# EAGLE design apollo-ctrl (EAGLE 7.6.0)
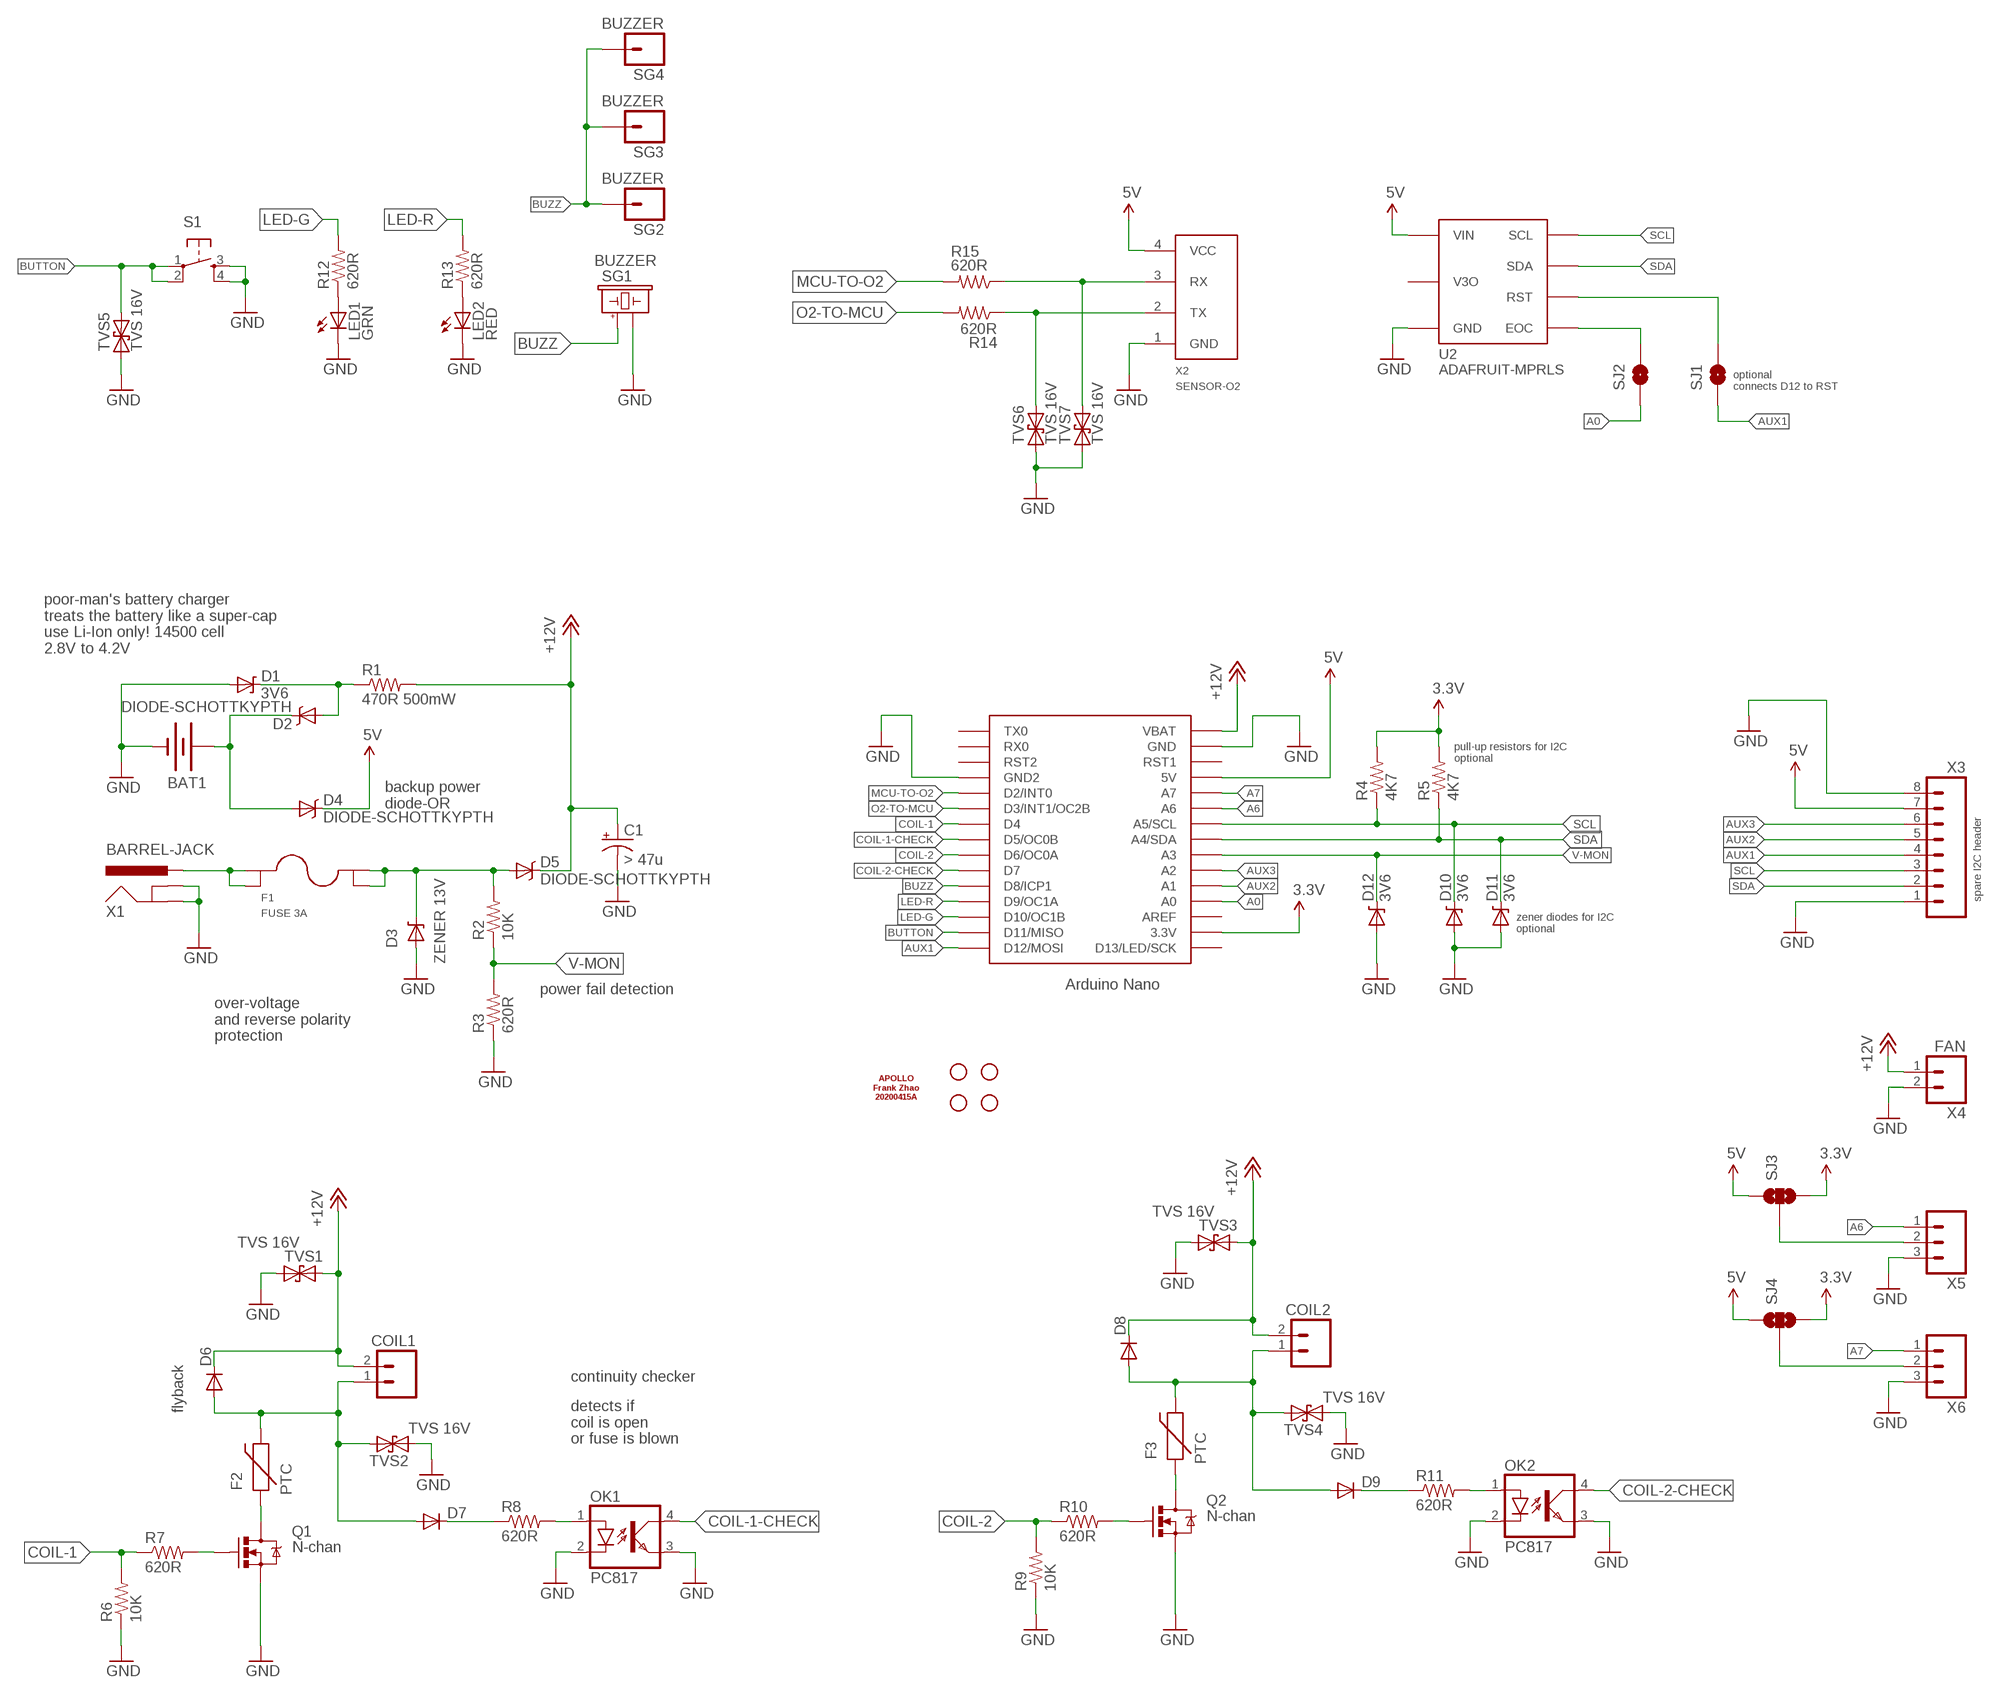
[diagram p0: schematic, sheet 1]

## Parts
BAT1  BATTERYAA-KIT  [BATTERY-AA-KIT]
C1  > 47u  CAP_POLPTH4  [CPOL-RADIAL-1000UF-25V]
COIL1  M023.5MM  [SCREWTERMINAL-3.5MM-2]
COIL2  M023.5MM  [SCREWTERMINAL-3.5MM-2]
D1  3V6  DIODE-ZENER1N4148  [DIODE-1N4148]
D2  DIODE-SCHOTTKYPTH  [DIODE-1N4001]
D3  ZENER 13V  DIODE-ZENER-DO201-15  [DO201-15]
D4  DIODE-SCHOTTKYPTH  [DIODE-1N4001]
D5  DIODE-SCHOTTKYPTH  [DIODE-1N4001]
D6  DIODE1N4148  [DIODE-1N4148]
D7  DIODE1N4148  [DIODE-1N4148]
D8  DIODE1N4148  [DIODE-1N4148]
D9  DIODE1N4148  [DIODE-1N4148]
D10  3V6  DIODE-ZENER1N4148  [DIODE-1N4148]
D11  3V6  DIODE-ZENER1N4148  [DIODE-1N4148]
D12  3V6  DIODE-ZENER1N4148  [DIODE-1N4148]
F1  FUSE 3A  FUSE-4PIN-KEYSTONE-3568  [FUSE-KEYSTONE-3568]
F2  PTC  PTCPTH  [PTC]
F3  PTC  PTCPTH  [PTC]
JP1  STAND-OFF  [STAND-OFF]
JP2  STAND-OFF  [STAND-OFF]
JP3  STAND-OFF  [STAND-OFF]
JP4  STAND-OFF  [STAND-OFF]
LED1  GRN  LED5MM  [LED5MM]
LED2  RED  LED5MM  [LED5MM]
LOGO1  APOLLO-LOGO  [APOLLO-LOGO]
OK1  PC817  [DIL04]
OK2  PC817  [DIL04]
Q1  N-chan  MOSFET-NCHANNELPTH2  [TO220V]
Q2  N-chan  MOSFET-NCHANNELPTH2  [TO220V]
R1  470R 500mW  RESISTORPTH-1/2W  [AXIAL-0.5]
R2  10K  RESISTORPTH-1/4W  [AXIAL-0.4]
R3  620R  RESISTORPTH-1/4W  [AXIAL-0.4]
R4  4K7  RESISTORPTH-1/4W  [AXIAL-0.4]
R5  4K7  RESISTORPTH-1/4W  [AXIAL-0.4]
R6  10K  RESISTORPTH-1/4W  [AXIAL-0.4]
R7  620R  RESISTORPTH-1/4W  [AXIAL-0.4]
R8  620R  RESISTORPTH-1/4W  [AXIAL-0.4]
R9  10K  RESISTORPTH-1/4W  [AXIAL-0.4]
R10  620R  RESISTORPTH-1/4W  [AXIAL-0.4]
R11  620R  RESISTORPTH-1/4W  [AXIAL-0.4]
R12  620R  RESISTORPTH-1/4W  [AXIAL-0.4]
R13  620R  RESISTORPTH-1/4W  [AXIAL-0.4]
R14  620R  RESISTORPTH-1/4W  [AXIAL-0.4]
R15  620R  RESISTORPTH-1/4W  [AXIAL-0.4]
S1  TAC_SWITCHPTH  [TACTILE-PTH]
SG1  BUZZER  BUZZER-POL-AI-3035  [BUZZER-AI-3035]
SG2  BUZZER  M01-TH-NS  [1X01NS]
SG3  BUZZER  M01-TH-NS  [1X01NS]
SG4  BUZZER  M01-TH-NS  [1X01NS]
SJ1  SOLDERJUMPERNO  [SJ_2S-NO]
SJ2  SOLDERJUMPERNO  [SJ_2S-NO]
SJ3  SOLDERJUMPER_2WAYS  [SJ_3]
SJ4  SOLDERJUMPER_2WAYS  [SJ_3]
TVS1  TVS 16V  TVS1N4148  [DIODE-1N4148]
TVS2  TVS 16V  TVS1N4148  [DIODE-1N4148]
TVS3  TVS 16V  TVS1N4148  [DIODE-1N4148]
TVS4  TVS 16V  TVS1N4148  [DIODE-1N4148]
TVS5  TVS 16V  TVS1N4148  [DIODE-1N4148]
TVS6  TVS 16V  TVS1N4148  [DIODE-1N4148]
TVS7  TVS 16V  TVS1N4148  [DIODE-1N4148]
U1  NANO  [NANO]
U2  ADAFRUIT-MPRLS  ADAFRUIT-MPRLS-W-HOLES  [ADAFRUIT-MPRLS]
X1  BARREL-JACK  POWER_JACKPTH  [POWER_JACK_PTH]
X2  SENSOR-O2  SENSOR-O2-JST-VERT  [JST-PH-4-VERT]
X3  M081X08  [1X08]
X4  FAN  M02PTH  [1X02]
X5  M03PTH  [1X03]
X6  M03PTH  [1X03]

## Nets
3.3V: R4.P$2 R5.P$2 SJ3.3 SJ4.3 U1.3.3V
5V: D4.C SJ3.1 SJ4.1 U1.5V U2.VIN X2.4(VCC) X3.7
+12V: C1.1(+) COIL1.2 COIL2.2 D5.C D6.C D8.C R1.P$2 TVS1.C TVS3.C U1.RAW(VBAT) X4.1
A0: SJ2.1 U1.A0
A6: U1.A6 X5.1
A7: U1.A7 X6.1
AUX1: SJ1.1 U1.D12(D12/MOSI) X3.4
AUX2: U1.A1 X3.5
AUX3: U1.A2 X3.6
BUTTON: S1.1 S1.2 TVS5.C U1.D11(D11/MISO)
BUZZ: SG1.P SG2.1 SG3.1 SG4.1 U1.D8(D8/ICP1)
COIL-1: R6.P$2 R7.P$1 U1.D4
COIL-1-CHECK: OK1.4(COL) U1.D5(D5/OC0B)
COIL-2: R9.P$2 R10.P$1 U1.D6(D6/OC0A)
COIL-2-CHECK: OK2.4(COL) U1.D7
GND: BAT1.GND@1(-) C1.2(-) D1.A D3.A D10.A D11.A D12.A LED1.K(C) LED2.K(C) OK1.2(C) OK1.3(EMIT) OK2.2(C) OK2.3(EMIT) Q1.3(S) Q2.3(S) R3.P$1 R6.P$1 R9.P$1 S1.3 S1.4 SG1.N TVS1.A TVS2.A TVS3.A TVS4.A TVS5.A TVS6.A TVS7.A U1.GND U1.GND1(GND2) U2.GND X1.GND X1.GNDBREAK X2.1(GND) X3.1 X3.8 X4.2 X5.3 X6.3
LED-G: R12.P$2 U1.D10(D10/OC1B)
LED-R: R13.P$2 U1.D9(D9/OC1A)
MCU-TO-O2: R15.P$2 U1.D2(D2/INT0)
N$1: SJ1.2 U2.RST
N$2: F2.1 Q1.2(D)
N$3: Q1.1(G) R7.P$2
N$4: OK1.1(A) R8.P$2
N$5: COIL1.1 D6.A D7.A F2.2 TVS2.C
N$6: F1.1A F1.1B X1.PWR
N$7: D7.C R8.P$1
N$8: OK2.1(A) R11.P$2
N$9: Q2.1(G) R10.P$2
N$10: COIL2.1 D8.A D9.A F3.2 TVS4.C
N$11: F3.1 Q2.2(D)
N$12: D9.C R11.P$1
N$13: D3.C D5.A F1.2A F1.2B R2.P$2
N$14: BAT1.PWR@1(+) D2.C D4.A
N$15: LED2.A R13.P$1
N$16: LED1.A R12.P$1
N$17: R14.P$1 TVS6.C X2.2(TX)
N$18: R15.P$1 TVS7.C X2.3(RX)
N$19: D1.C D2.A R1.P$1
N$20: SJ2.2 U2.EOC
N$21: SJ4.2 X6.2
N$22: SJ3.2 X5.2
O2-TO-MCU: R14.P$2 U1.D3(D3/INT1/OC2B)
SCL: D10.C R4.P$1 U1.A5(A5/SCL) U2.SCL X3.3
SDA: D11.C R5.P$1 U1.A4(A4/SDA) U2.SDA X3.2
V-MON: D12.C R2.P$1 R3.P$2 U1.A3
Unconnected: U1.AREF U1.D13(D13/LED/SCK) U1.RST1(RST2) U1.RST(RST1) U1.RX0 U1.TX0 U2.V3O

## Notes on the sheet
- optional
  connects D12 to RST
- poor-man's battery charger
  treats the battery like a super-cap
  use Li-Ion only! 14500 cell
  2.8V to 4.2V
- pull-up resistors for I2C
  optional
- backup power
  diode-OR
- spare I2C header
- zener diodes for I2C
  optional
- power fail detection
- over-voltage
  and reverse polarity
  protection
- continuity checker
- flyback
- detects if
  coil is open
  or fuse is blown

## Library data of the parts
BAT1 = apollo-ctrl:BATTERY: Battery Holders Various common sizes : AA, AAA, 20mm coin cell and 12mm coin cell.
C1 = apollo-ctrl:CAP_POL: Capacitor Polarized These are standard SMD and PTH capacitors. Normally 10uF, 47uF, and 100uF in electrolytic and tantalum varieties. Always verify the external diameter of the through hole cap, it varies with capacity, voltage, and manufacturer. The EIA devices should be standard.
COIL1 COIL2 X4 = apollo-ctrl:M02: Header 2 Standard 2-pin 0.1" header. Use with straight break away headers (SKU : PRT-00116), right angle break away headers (PRT-00553), swiss pins (PRT-00743), machine pins (PRT-00117), and female headers (PRT-00115). Molex polarized connector foot print use with SKU : PRT-08233 with associated crimp pins and housings.
D1 D3 D10-D12 = apollo-ctrl:DIODE-ZENER: Zener Diode Production Part - 8199 3.4V Zener Voltage
D2 D4 D5 = apollo-ctrl:DIODE-SCHOTTKY
D6-D9 = apollo-ctrl:DIODE: Diode These are standard reverse protection diodes and small signal diodes. SMA package can handle up to about 1A. SOD-323 can handle about 200mA. What the SOD-323 package when ordering, there are some mfgs out there that are 5-pin packages.
F1 = apollo-ctrl:FUSE-4PIN
F2 F3 = apollo-ctrl:PTC: Resettable Fuse PTC Resettable Fuse. Spark Fun Electronics SKU : COM-08357; SKU: RHEF070HF-ND
JP1-JP4 = apollo-ctrl:STAND-OFF: Stand Off This is the mechanical footprint for a #4 phillips button head screw. Use the keepout ring to avoid running the screw head into surrounding components. SKU : PRT-00447
LED1 LED2 = apollo-ctrl:LED: LEDs Standard schematic elements and footprints for 5mm, 3mm, 1206, and 0603 sized LEDs. 5mm - Spark Fun Electronics SKU : COM-00529 (and others)
LOGO1 = apollo-ctrl:APOLLO-LOGO
OK1 OK2 = apollo-ctrl:PC817: SHARP OPTO COUPLER; MPN: PC817X4J000F; OC_FARNELL: 9707727; OC_NEWARK: 97K7059
Q1 Q2 = apollo-ctrl:MOSFET-NCHANNEL
R1-R15 = apollo-ctrl:RESISTOR: Resistor Basic schematic elements and footprints for 0603, 1206, and PTH resistors.
S1 = apollo-ctrl:TAC_SWITCH: Momentary Switch Button commonly used for reset or general input. Spark Fun Electronics SKU : COM-00097
SG1 = apollo-ctrl:BUZZER-POL
SG2-SG4 = apollo-ctrl:M01: Header 1 Standard 1-pin 0.1" header. Use with straight break away headers (SKU : PRT-00116), right angle break away headers (PRT-00553), swiss pins (PRT-00743), machine pins (PRT-00117), and female headers (PRT-00115).
SJ1 SJ2 = apollo-ctrl:SOLDERJUMPER: Solder Jumper Standard SMD solder jumper. Used to automate production. Two varients : Normally Open and Normally Closed are the same, but have different paste layers. NC will have a large amount of paste and should jumper during reflow.
SJ3 SJ4 = apollo-ctrl:SOLDERJUMPER_2WAY: Solder Jumper 2 way solder jumper
TVS1 TVS3 TVS5-TVS7 = apollo-ctrl:TVS
TVS2 TVS4 = apollo-ctrl:TVS; SKU: P6KE16CALFCT-ND
U1 = apollo-ctrl:NANO: Arduino Nano
U2 = apollo-ctrl:ADAFRUIT-MPRLS
X1 = apollo-ctrl:POWER_JACK: Power Jack This is the standard 5.5mm barrel jack for power. The PTH is the most common, proven, reliable, footprint. All others are experimental. The Slot footprint only works if the mill layer is transmitted to the PCB fab house so be warned. Spark Fun Electronics SKU : PRT-00119. Mating wall wart : TOL-00298 (and others)
X2 = apollo-ctrl:SENSOR-O2
X3 = apollo-ctrl:M08: Header 8 Standard 8-pin 0.1" header. Use with straight break away headers (SKU : PRT-00116), right angle break away headers (PRT-00553), swiss pins (PRT-00743), machine pins (PRT-00117), and female headers (PRT-00115).
X5 X6 = apollo-ctrl:M03: Header 3 Standard 3-pin 0.1" header. Use with straight break away headers (SKU : PRT-00116), right angle break away headers (PRT-00553), swiss pins (PRT-00743), machine pins (PRT-00117), and female headers (PRT-00115). Molex polarized connector foot print use with SKU : PRT-08232 with associated crimp pins and housings.

## Board
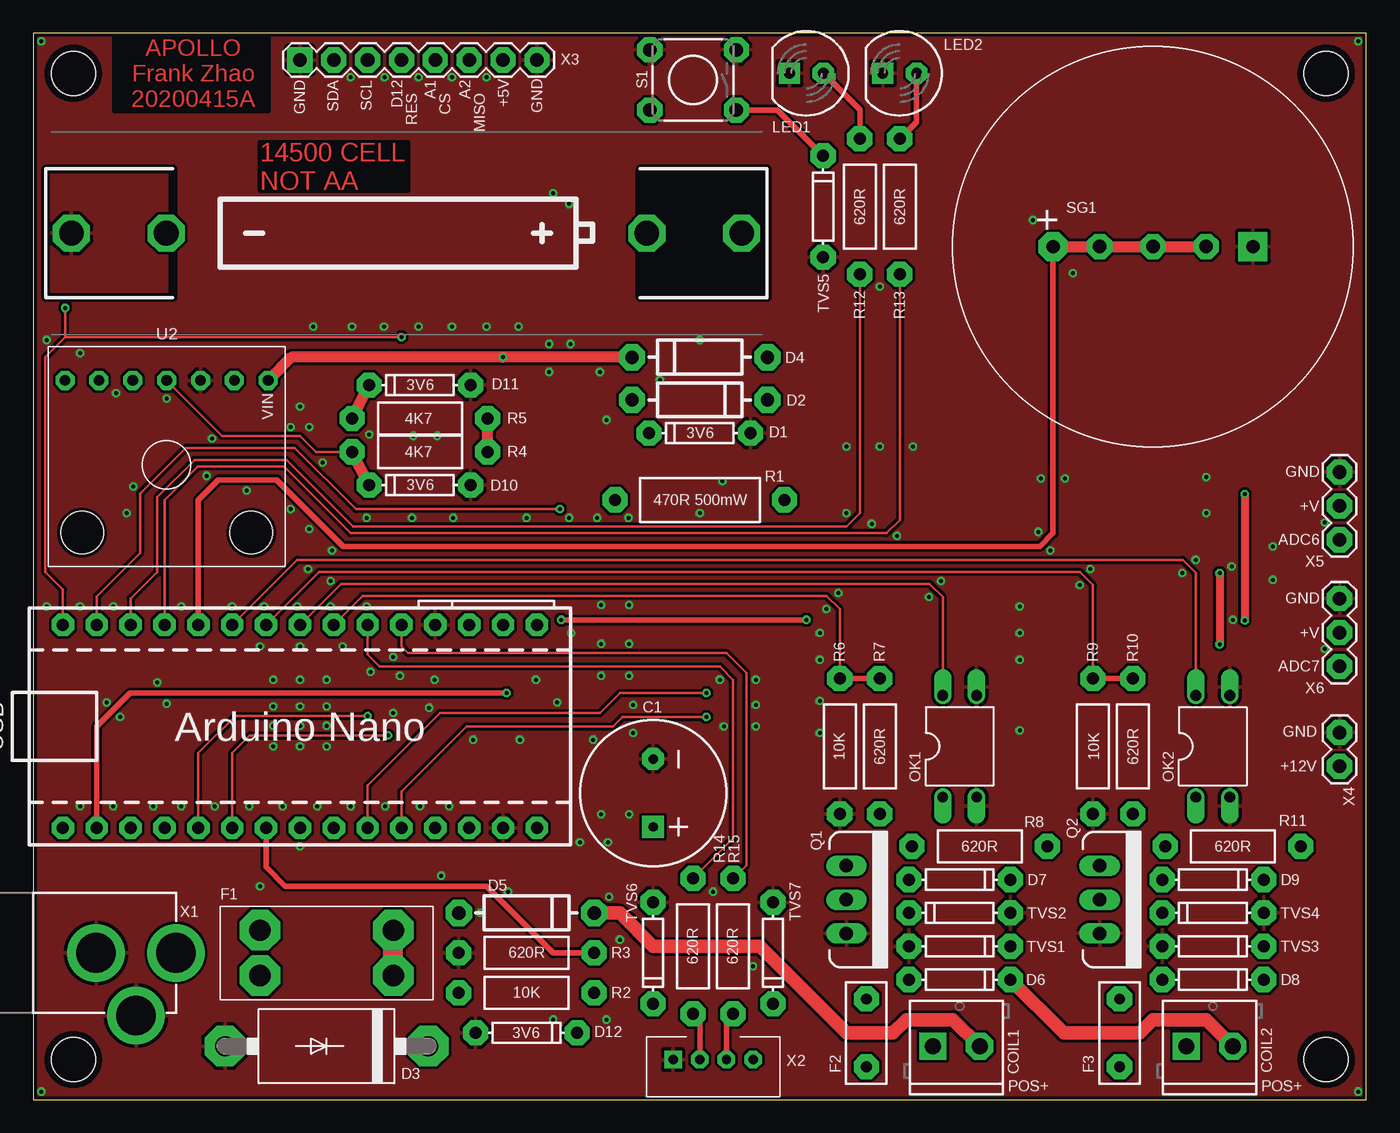
[diagram p1: board, top side]
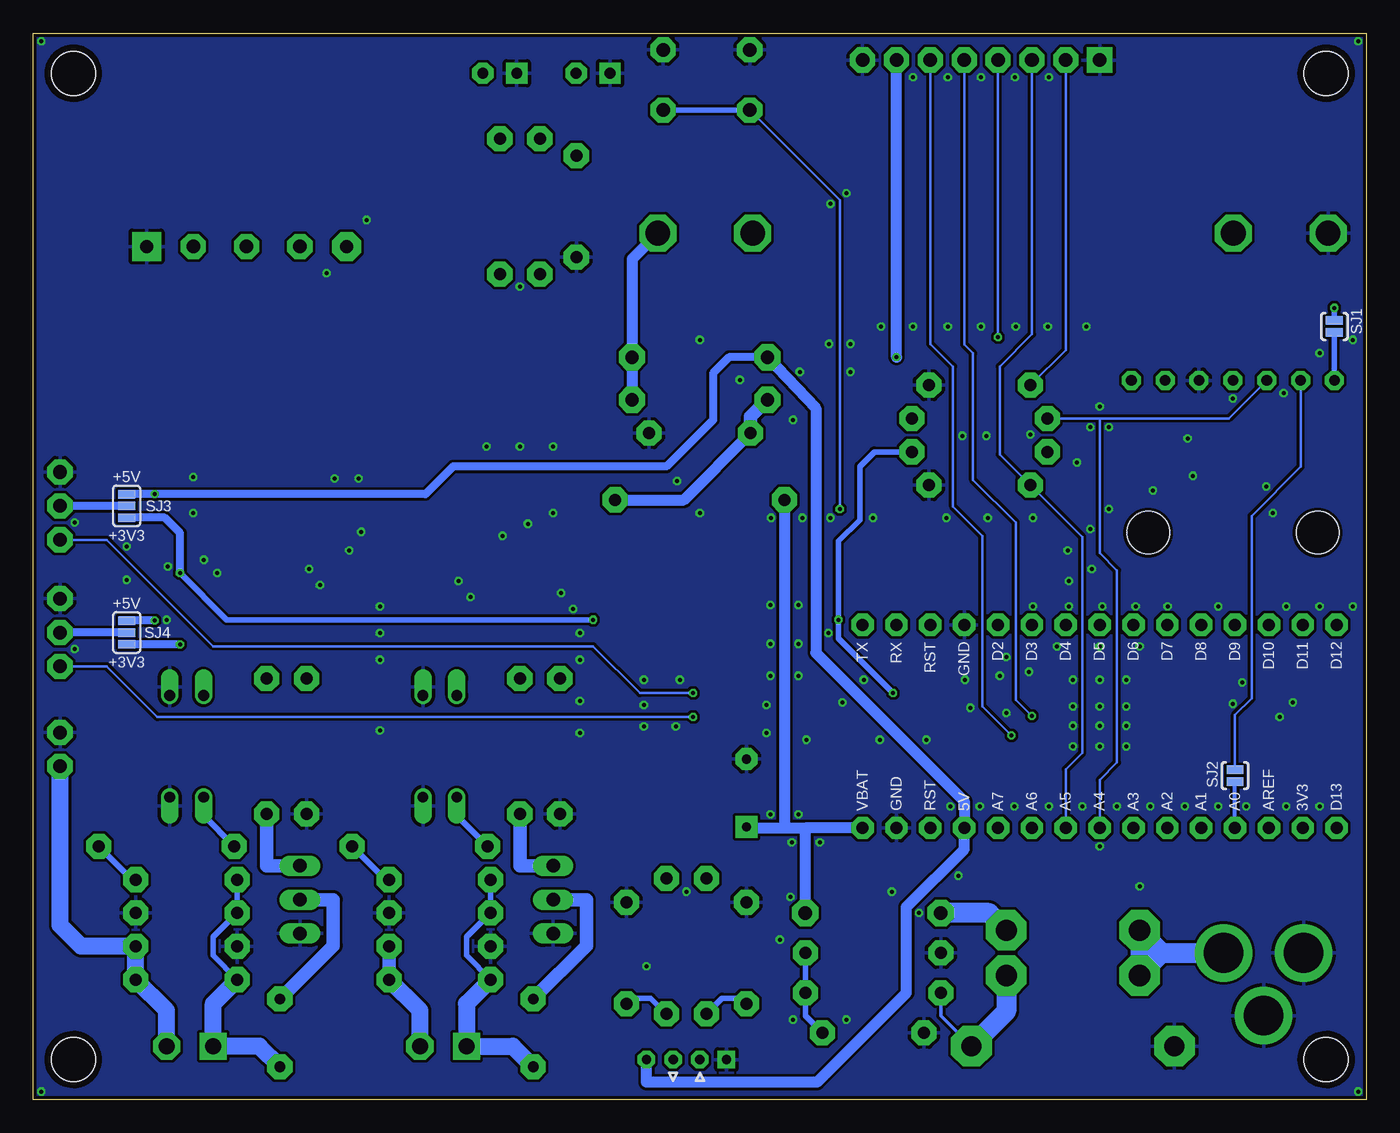
[diagram p2: board, bottom side, seen from below]

Size 100 x 80 mm. Coordinates in mm from the lower left corner, seen from the top.
Outline: 0,0 100,0 100,80 0,80 0,0
Copper layers (1*16): Top 0.035mm / dielectric 1.5mm / Bottom 0.035mm
Design rules "drc_rules *": minimum track width 6mil, minimum drill 0.3mm, track to track 8mil, track to pad 8mil, pad to pad 8mil, via to via 8mil, smd to smd 0mil, copper to edge 10mil, drill to drill 10mil, minimum pad ring 10mil, minimum via ring 6mil, stop-mask expansion 2mil, vias tented up to drill 25mil, thermal gap 10mil

### Footprints (pad centres in the part's own frame; a part is rotated, then mirrored left to right if it is on the bottom)
BATTERY-AA-KIT = drill 1.854 octagon: GND@1 25.146,0; GND@2 18.034,0; PWR@1 -25.146,0; PWR@2 -18.034,0
CPOL-RADIAL-1000UF-25V = drill 0.7 pad 1.651 square: 1 2.54,0 | drill 0.7 pad 1.651 octagon: 2 -2.54,0
SCREWTERMINAL-3.5MM-2 = drill 1.2 pad 2.032 square: 1 0,0 | drill 1.2 pad 2.032 octagon: 2 3.5,0
DIODE-1N4148 = drill 0.9 pad 1.88 octagon: A -3.81,0; C 3.81,0
DIODE-1N4001 = drill 1 pad 1.981 octagon: A -5.08,0; C 5.08,0
DO201-15 = drill 1.499 pad 3.048 octagon: A 7.62,0; C -7.62,0
FUSE-KEYSTONE-3568 = drill 1.6 pad 3.048 octagon: 1A -5,1.7; 1B -5,-1.7; 2A 5,1.7; 2B 5,-1.7
PTC = drill 0.8 pad 1.88 octagon: 1 -2.54,0; 2 2.54,0
STAND-OFF = hole 3.302: 0,0
LED5MM = drill 0.813 pad 1.6 octagon: A -1.27,0 | drill 0.813 pad 1.6 square: K 1.27,0
DIL04 = drill 0.813 offset: 1 -1.27,-3.81; 2 1.27,-3.81; 3 1.27,3.81; 4 -1.27,3.81
TO220V = drill 1.016 long: 1 -2.54,0; 2 0,0; 3 2.54,0
AXIAL-0.5 = drill 0.9 pad 1.88 octagon: P$1 -6.35,0; P$2 6.35,0
AXIAL-0.4 = drill 0.9 pad 1.88 octagon: P$1 -5.08,0; P$2 5.08,0
TACTILE-PTH = drill 1.016 pad 1.88 octagon: 1 -3.251,2.261; 2 3.251,2.261; 3 -3.251,-2.261; 4 3.251,-2.261
BUZZER-AI-3035 = drill 1 pad 2.184 square: N 0,-7.5 | drill 1 pad 2.184 octagon: P 0,7.5
1X01NS = drill 1.016 pad 1.88 octagon: 1 0,0
SJ_2S-NO = smd 0.635 x 1.27: 1 -0.45,0; 2 0.45,0
SJ_3 = smd 0.635 x 1.27: 1 -0.889,0; 2 0,0; 3 0.889,0
NANO = drill 0.9 pad 1.676 octagon: 3.3V -7.62,15.24; 5V -7.62,-10.16; A0 -7.62,10.16; A1 -7.62,7.62; A2 -7.62,5.08; A3 -7.62,2.54; A4 -7.62,0; A5 -7.62,-2.54; A6 -7.62,-5.08; A7 -7.62,-7.62; AREF -7.62,12.7; D2 7.62,-7.62; D3 7.62,-5.08; D4 7.62,-2.54; D5 7.62,0; D6 7.62,2.54; D7 7.62,5.08; D8 7.62,7.62; D9 7.62,10.16; D10 7.62,12.7; D11 7.62,15.24; D12 7.62,17.78; D13 -7.62,17.78; GND -7.62,-15.24; GND1 7.62,-10.16; RAW -7.62,-17.78; RST -7.62,-12.7; RST1 7.62,-12.7; RX0 7.62,-15.24; TX0 7.62,-17.78
ADAFRUIT-MPRLS = drill 0.8 pad 1.422 octagon: EOC 5.08,2.54; GND -2.54,2.54; RST 7.62,2.54; SCL 0,2.54; SDA 2.54,2.54; V3O -5.08,2.54; VIN -7.62,2.54 | hole 3.2: -6.35,13.97; 6.35,13.97
POWER_JACK_PTH = drill 2.997 pad 4.318: GND 0,7.7; GNDBREAK 4.7,10.7; PWR 0,13.7
JST-PH-4-VERT = drill 0.7 pad 1.321 square: 1 -3,0 | drill 0.7 pad 1.321 octagon: 2 -1,0; 3 1,0; 4 3,0
1X08 = drill 1.016 pad 1.88 square: 1 0,0 | drill 1.016 pad 1.88 octagon: 2 2.54,0; 3 5.08,0; 4 7.62,0; 5 10.16,0; 6 12.7,0; 7 15.24,0; 8 17.78,0
1X02 = drill 1.016 pad 1.88 octagon: 1 0,0; 2 2.54,0
1X03 = drill 1.016 pad 1.88 octagon: 1 0,0; 2 2.54,0; 3 5.08,0

### Placement (x,y rotation side)
BAT1  28,65 180 top
C1  46.5,23 270 top
COIL1  67.5,4 0 top
COIL2  86.5,4 0 top
D1  50,50 180 top
D2  50,52.5 0 top
D3  22,4 180 top
D4  50,55.7 180 top
D5  37,14 0 top
D6  69.5,9 0 top
D7  69.5,16.5 0 top
D8  88.5,9 0 top
D9  88.5,16.5 0 top
D10  29,46.1 180 top
D11  29,53.6 180 top
D12  37,5 0 top
F1  22,11 0 top
F2  62.5,5 270 top
F3  81.5,5 270 top
JP1  3,3 0 top
JP2  97,3 0 top
JP3  97,77 0 top
JP4  3,77 0 top
LED1  58,77 180 top
LED2  65,77 180 top
LOGO1  12,77 0 top
OK1  69.5,26.5 0 top
OK2  88.5,26.5 0 top
Q1  61,15 270 top
Q2  80,15 270 top
R1  50,45 180 top
R2  37,8 180 top
R3  37,11 0 top
R4  29,48.6 0 top
R5  29,51.1 0 top
R6  60.5,26.5 90 top
R7  63.5,26.5 270 top
R8  71,19 180 top
R9  79.5,26.5 90 top
R10  82.5,26.5 270 top
R11  90,19 180 top
R12  62,67 270 top
R13  65,67 270 top
R14  49.5,11.5 90 top
R15  52.5,11.5 90 top
S1  49.5,76.5 180 top
SG1  84,64 90 top
SG2  88,64 0 top
SG3  84,64 0 top
SG4  80,64 0 top
SJ1  2.38,58 270 bottom
SJ2  9.84,24.3 90 bottom
SJ3  93,44.54 270 bottom
SJ4  93,35.04 270 bottom
TVS1  69.5,11.5 0 top
TVS2  69.5,14 180 top
TVS3  88.5,11.5 0 top
TVS4  88.5,14 180 top
TVS5  59.26,67 90 top
TVS6  46.5,11 270 top
TVS7  55.5,11 270 top
U1  20,28 90 top
U2  10,56.5 180 top
X1  -3,11 270 top
X2  51,3 0 top
X3  20,78 0 top
X4  98,25 90 top
X5  98,42 90 top
X6  98,32.5 90 top

### Tracks (layer width: path | path; a pad name or v marks a point on that pad's centre or on a via)
3.3V  (via drill 0.3)
  Top 0.406: U1.3.3V 4.76,27.99 7.27,30.5 v35.5,30.5 | v39.6,36 v58,36
  Top 0.61: v89,39.5 v89,34.15
  Top 0.813: R4.P$2 R5.P$2
  Bottom 0.406: v35.5,30.5 39.6,34.6 v39.6,36 39.6,41.9 38,43.5 38,47.5 36.9,48.6 R4.P$2 | v58,36 85.5,36 v89,39.5
  Bottom 0.61: v89,34.15 SJ4.3 | v89,39.5 89,42.5 90.15,43.65 SJ3.3
5V  (via drill 0.3)
  Top 0.61: v90.89,45.43 v90.89,35.93
  Top 0.813: D4.C v35.24,55.7 19.36,55.7 U2.VIN
  Bottom 0.61: D4.C 47.8,55.7 49,54.5 49,51 52.5,47.5 68.5,47.5 70.57,45.43 v90.89,45.43 SJ3.1 | v90.89,35.93 SJ4.1
  Bottom 0.813: D4.C 41.3,51.88 41.3,33.52 30.16,22.38 U1.5V 30.16,18.78 34.5,14.44 34.5,8 41.2,1.3 54,1.3 X2.4 | v35.24,55.7 X3.7
+12V
  Top 1.016: D6.C 77.31,5 83,5 84,6 88,6 COIL2.2 | COIL1.2 69,6 65.5,6 64.5,5 61,5 54.5,11.5 46.5,11.5 44,14 D5.C
  Bottom 0.813: U1.RAW 42.08,20.38 | C1.1 46.42,20.38 43.65,20.38 | D5.C 42.08,20.38 | R1.P$2 43.65,20.38 | 43.65,20.38 42.08,20.38
  Bottom 1.016: D6.C TVS1.C
  Bottom 1.27: COIL1.2 71,6.69 D6.C | COIL2.2 90,6.69 D8.C TVS3.C 96.42,11.5 98,13.08 X4.1
A0
  Bottom 0.305: U1.A0 SJ2.1
A6  (via drill 0.3)
  Top 0.203: U1.A6 25.08,23.58 30.5,29 42.5,29 44,30.5 v50.5,30.5
  Bottom 0.203: v50.5,30.5 54.5,30.5 58,34 86.5,34 94.5,42 X5.1
A7  (via drill 0.3)
  Top 0.203: U1.A7 27.62,23.12 32.5,28 43.5,28 44.2,28.7 v50.5,28.7
  Bottom 0.203: v50.5,28.7 90.7,28.7 94.5,32.5 X6.1
AUX1  (via drill 0.3)
  Top 0.203: 2.38,57.2 v27.62,57.2 | U1.D12 2.22,38.28 0.9,39.6 0.9,55.72 2.38,57.2 | 2.38,57.2 v2.38,59.4
  Bottom 0.203: v27.62,57.2 X3.4
  Bottom 0.406: SJ1.1 v2.38,59.4
AUX2  (via drill 0.3)
  Top 0.203: U1.A1 12.38,26 15.16,28.78 v25.08,28.78
  Bottom 0.203: X3.5 30.16,56.66 29.5,56 29.5,46.5 26.3,43.3 26.3,30 v25.08,28.78
AUX3  (via drill 0.3)
  Top 0.203: U1.A2 14.92,26 16.24,27.32 v26.62,27.32
  Bottom 0.203: X3.6 32.7,56.7 31,55 31,44.5 28.8,42.3 28.8,29.5 v26.62,27.32
BUTTON  (via drill 0.3)
  Top 0.203: v39.5,44.3 24.2,44.3 19.6,48.9 11.44,48.9 8,45.46 8,41 4.76,37.76 U1.D11
  Top 0.406: TVS5.C 55.83,74.24 S1.1
  Bottom 0.203: v39.5,44.3 39.5,67.49 S1.2
  Bottom 0.406: S1.2 S1.1
BUZZ
  Top 0.406: SG1.P 76.5,42.5 75.5,41.5 23.26,41.5 18.26,46.5 13.88,46.5 12.38,44.99 U1.D8
  Top 0.813: SG1.P SG4.1 SG3.1 SG2.1
COIL-1
  Top 0.203: R6.P$2 60.5,36.8 59.5,37.8 24.72,37.8 U1.D4
  Top 0.406: R7.P$1 R6.P$2
COIL-1-CHECK
  Top 0.203: OK1.4 68.23,37.7 67.23,38.7 23.08,38.7 U1.D5
COIL-2
  Top 0.203: R9.P$2 79.5,38.6 78.5,39.6 21.44,39.6 U1.D6
  Top 0.406: R10.P$1 R9.P$2
COIL-2-CHECK
  Top 0.203: U1.D7 19.8,40.5 86.23,40.5 87.23,39.5 OK2.4
GND  (via drill 0.3)
  other vias: 6,37 11.1,37 14.9,37 17.3,37 19.8,37 22.3,37 25,37 3.5,37 30.1,31.5 41,19.3 43.1,19.3 44.7,21.4 42.6,21.4 6.5,28.7 5.5,29.8 20,19 21.3,22 18.7,22 23.8,22 20,34 17,34 23.2,34 3.5,22 6,22 20.7,42.8 19.3,44.3 21.7,47.8 20.6,39.8 22.3,38.9 63.5,61 64.8,42.3 51,15.6 17,16 30.6,16.8 33.55,14 35.6,15.6 39,6 43,6 44,12 43.2,15.2 54,10 51.5,31.5 44.7,31.8 42.6,31.8 42.6,34.2 44.7,34.2 44.7,37.1 42.6,37.1 40.2,43.65 44.65,43.65 59.5,36.8 60.4,38 67.2,37.7 68.1,38.9 78.5,38.6 79.3,39.8 76.3,41.2 75.4,42.6 86.2,39.5 87.2,40.5 61,44 62.9,43.2 42.5,54.6 40.2,67.2 39,68 42.3,43.65 29,22 31.2,22 37.7,31.5 40.35,35 40.3,56.7 38.7,56.7 38.7,54.6 23.9,58 23.8,76.7 26.35,76.7 28.9,76.7 27,33.2 25.3,32.1 27.5,31.8 26.4,22 31.4,76.7 34,76.7 21,58 26.3,58 13.6,22 11.1,22 16.2,22 18,29.5 18,26.5 20,26.5 20,29.5 20,28.05 18,28.05 22,28.05 22,29.5 22,26.5 13,46.8 18,31.5 20,31.5 22,31.5 1,37 1,57 3.5,56 10,52.6 22.4,41.2 25,43.65 28.5,49.8 30.3,49.8 25.2,49.9 28.9,58 31.4,58 34,58 36.4,58 28.4,43.65 31.5,43.65 37,43.65 9,22 10,29.7 7,44 7.5,46 9.3,31.3 16,45.7 6.2,53 13.4,49.6 20.7,50.45 20,52 19.3,50.45 59,29.9 59,27.5 59,33 59,35 74,35 74,33 74,27.7 93,39 93,41.5 96.9,43.3 96.9,33.8 63.5,49 61,49 66,49 75.6,46.6 77.4,46.6 75,66 78,62 99.4,79.4 99.4,0.6 0.6,0.6 0.6,79.4 42,27 45,27.5 45,29.6 54.2,28 51.8,28 54.2,29.6 54.2,31.5 27,29 29.7,29.4 33,27 36.5,27 39.3,29.8 47,54 51.7,46.4 50,44 43,51 50,57 74,37 89.9,40 90,36 88,44 88,46.7
  pour Top (isolate 0.203): 0,0 0,80 100,80 100,0
  pour Bottom (isolate 0.203): 0,0 0,80 100,80 100,0
LED-G
  Top 0.203: R12.P$2 62,44 61,43 24,43 19,48 12.1,48 9.3,45.2 9.3,39.6 7.3,37.6 U1.D10
LED-R
  Top 0.203: R13.P$2 65,43.5 64,42.5 23.8,42.5 18.8,47.5 12.35,47.5 9.84,44.99 U1.D9
MCU-TO-O2
  Top 0.203: U1.D2 27.62,34 28.12,33.5 52,33.5 53.5,32 53.5,17.58 R15.P$2
N$1
  Bottom 0.406: U2.RST SJ1.2
N$2
  Bottom 1.016: F2.1 58.5,11.54 58.5,15 Q1.2
N$3
  Bottom 1.016: Q1.1 63.5,17.54 R7.P$2
N$4
  Bottom 0.406: R8.P$2 68.23,21.31 OK1.1
N$5
  Bottom 0.406: D6.A 67.5,10.81 67.5,12.19 TVS2.C D7.A
  Bottom 1.27: F2.2 64.04,4 COIL1.1 67.5,7.19 D6.A
N$6
  Bottom 1.422: F1.1B 15.3,11 F1.1A 17,10
  Bottom 1.5: 15.3,11 X1.PWR
N$7
  Bottom 0.406: D7.C 73.58,16.5 R8.P$1
N$8
  Bottom 0.406: R11.P$2 87.23,21.31 OK2.1
N$9
  Bottom 1.016: Q2.1 82.5,17.54 R10.P$2
N$10
  Bottom 0.406: D8.A 86.5,10.81 86.5,12.19 TVS4.C D9.A
  Bottom 1.27: F3.2 83.04,4 COIL2.1 86.5,7.19 D8.A
N$11
  Bottom 1.016: F3.1 77.5,11.54 77.5,15 Q2.2
N$12
  Bottom 0.406: D9.C 92.58,16.5 R11.P$1
N$13
  Top 1.5: F1.2B F1.2A
  Bottom 0.254: R2.P$2 31.92,6.3 D3.C
  Bottom 1.5: F1.2A 28.3,14 D5.A | F1.2B 27,6.62 D3.C
N$14
  Bottom 0.813: BAT1.PWR@1 55.08,63.07 D4.A D2.C
N$15
  Top 0.406: R13.P$1 66.27,73.35 LED2.A
N$16
  Top 0.406: R12.P$1 62,74.27 LED1.A
N$17
  Top 0.406: X2.2 50,5.92 R14.P$1
  Bottom 0.406: R14.P$1 48.32,7.6 46.5,7.6 TVS6.C
N$18
  Top 0.406: X2.3 52,5.92 R15.P$1
  Bottom 0.406: R15.P$1 53.68,7.6 55.5,7.6 TVS7.C
N$19
  Bottom 0.813: R1.P$1 51.19,45 D1.C
  Bottom 1.016: D1.C 46.19,51.23 D2.A
N$20
  Bottom 0.203: SJ2.2 9.84,28.84 8.6,30.08 8.6,43.8 4.92,47.48 U2.EOC
N$21
  Bottom 0.61: SJ4.2 X6.2
N$22
  Bottom 0.61: SJ3.2 X5.2
O2-TO-MCU
  Top 0.203: U1.D3 25.08,33.4 25.98,32.5 51.5,32.5 52.5,31.5 52.5,19.58 R14.P$2
SCL
  Top 0.203: R4.P$1 21.2,48.6 20,49.8 14.16,49.8 U2.SCL
  Top 0.813: D10.C R4.P$1
  Bottom 0.203: U1.A5 22.54,24.78 21.3,26.02 21.3,42.21 D10.C 27.5,48.41 27.5,55 25.08,57.42 X3.3
SDA
  Top 0.813: R5.P$1 D11.C
  Bottom 0.203: U1.A4 20,23.98 18.7,25.28 18.7,39.7 20,41 20,51.1 | X3.2 22.54,56.25 D11.C | 20,51.1 R5.P$1 | U2.SDA 10.32,51.1 20,51.1
V-MON
  Top 0.406: R3.P$2 39,11 34,16 18.91,16 17.46,17.45 U1.A3
  Bottom 0.406: R3.P$2 R2.P$1 42.08,6.27 D12.C

### Text on the board
Top: 14500 CELL / NOT AA
tPlace: +5V | GND | GND | SDA | SCL | D12 | RES | A1 | CS | A2 | MISO | VIN | GND | +V | ADC6 | GND | +V | ADC7 | GND | +12V | POS+ | POS+
bPlace: +5V | +3V3 | +5V | +3V3
tStop: 14500 CELL / NOT AA